# Altium schematic sheet SENSOR.SchDoc
size A; SheetNumber: 4; SheetTotal: 7
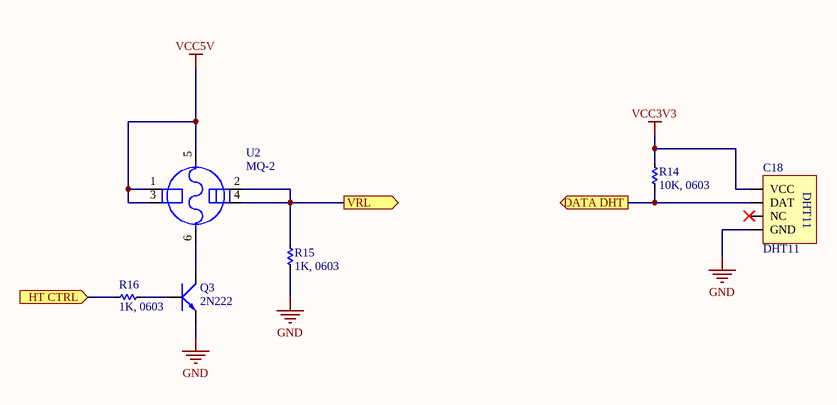
[diagram p0: SENSOR.SchDoc]

## Parts
C18  DHT11  [DHT11]
Q3  2N222  [TO92-123]
R14  10K, 0603  [RES-SMD-0603]
R15  1K, 0603  [RES-SMD-0603]
R16  1K, 0603  [RES-SMD-0603]
U2  MQ-2  [SNR6-D19.0MM]

## Ports
DATA DHT (out), HT CTRL (in), VRL (out)

## Nets
GND: C18.4(GND) Q3.1(E) R15.2
VCC3V3: C18.1(VCC) R14.2
VCC5V: U2.1(A0) U2.3(A1) U2.5(H@1)
DATA DHT: C18.2(DAT) R14.1 ; port DATA DHT
HT CTRL: R16.2 ; port HT CTRL
VRL: R15.1 U2.2(B0) U2.4(B1) ; port VRL
NetQ3_2: Q3.2(B) R16.1
NetQ3_3: Q3.3(C) U2.6(H@2)

Not connected (* = marked no-connect by the designer): C18 3(NC)*

## Library data of the parts
C18 = DHT11: Manufacturer: W¨¹rth Elektronik eiSos GmbH; partNo: 613004143121; ComponentLink1 Description: Manufacturer; ComponentLink2 Description: Datasheet; NoPins: 04; Created Date: 29 March 2013; ComponentLink1URL: http://www.we-online.com; ComponentLink2URL: http://katalog.we-online.de/em/datasheet/6130xx143121.pdf; Created by: Karrer Zheng
Q3 = 2N222: NPN 600mW, ECB; Value: C1815
R14-R16 = Res-SMD: Resistor; Manufacturer: Generic Components; Class: Passive; Published: 08/06/2000; Publisher: Altium Hobart Technology Centre
U2 = DIP-GAS-MQ-2(6P-D19MM): 314100003; MF: {'manufacturer': u'AirBorn'}; Package: None; Price: None; Value: *; MP: MQ-2; Availability: Unavailable